# Altium schematic sheet Sheet1.SchDoc
size A4
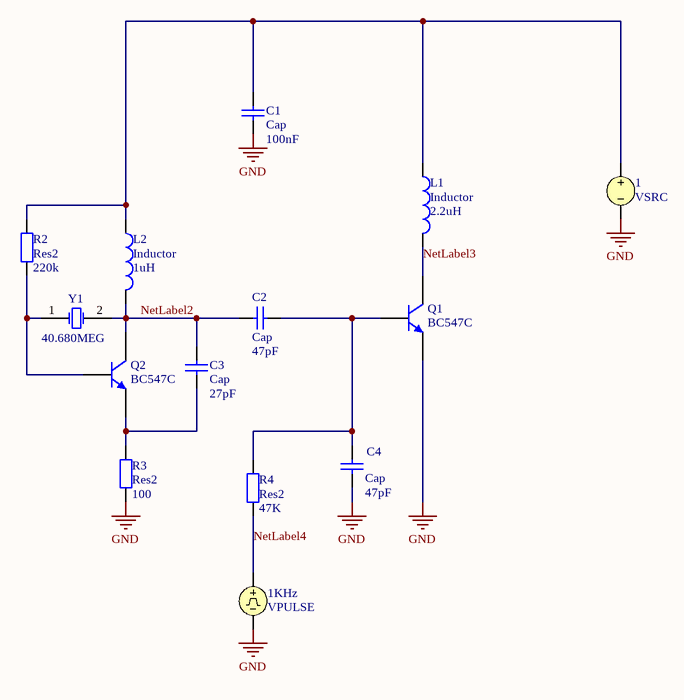
[diagram p0: Sheet1.SchDoc]

## Parts
1  VSRC
1KHz  VPULSE
C1  Cap  value 100nF  [RAD-0.3]
C2  Cap  value 47pF  [RAD-0.3]
C3  Cap  value 27pF  [RAD-0.3]
C4  Cap  value 47pF  [RAD-0.3]
L1  Inductor  value 2.2uH  [L0603]
L2  Inductor  value 1uH  [L0603]
Q1  BC547C  [SOT54]
Q2  BC547C  [SOT54]
R2  Res2  value 220k  [AXIAL-0.4]
R3  Res2  value 100  [AXIAL-0.4]
R4  Res2  value 47K  [AXIAL-0.4]
Y1  FREQ: 40.680MEG  [HC-49U]  (hidden comment: ECS-498.6-20-1)

## Nets
GND: 1.2 1KHz.2 C1.1 C4.1 Q1.1(E) R3.1
NetLabel2: C2.1 C3.2 L2.2 Q2.3(C) Y1.2(OSC2)
NetLabel3: L1.2 Q1.3(C)
NetLabel4: 1KHz.1 R4.1
Net1_1: 1.1 C1.2 L1.1 L2.1 R2.2
NetC2_2: C2.2 C4.2 Q1.2(B) R4.2
NetC3_1: C3.1 Q2.1(E) R3.2
NetQ2_2: Q2.2(B) R2.1 Y1.1(OSC1)

## Library data of the parts
1 = VSRC: Voltage Source; Note: PCB Footprint - Not required; Value: +9; Published: 8-Jun-2000; LatestRevisionDate: 17-Jul-2002; LatestRevisionNote: Re-released for DXP Platform.; PackageReference: Not Applicable; Publisher: Altium Limited
1KHz = VPULSE: Pulse Voltage Source; Note: PCB Footprint - Not required; Published: 8-Jun-2000; LatestRevisionDate: 15-Nov-2004; LatestRevisionNote: Corrected Netlist.; PackageReference: Not Applicable; Publisher: Altium Limited
C1-C4 = Cap: Capacitor; Published: 8-Jun-2000; LatestRevisionDate: 17-Jul-2002; LatestRevisionNote: Re-released for DXP Platform.; PackageReference: RAD-0.3; Publisher: Altium Limited
L1 L2 = Inductor: Code_IEC: 1005; Published: 8-Jun-2000; LatestRevisionDate: 17-Jul-2002; LatestRevisionNote: Re-released for DXP Platform.; PackageReference: 0402-A; Publisher: Altium Limited; Code_JEITA: 0402
Q1 Q2 = BC547C: NPN General-purpose Transistor; Published: 17-Sep-2003; LatestRevisionDate: 12-Dec-2006; LatestRevisionNote: Footprint pad sequence fixed.; DatasheetVersion: 15-Apr-1999; PackageVersion: Feb-1997; PackageReference: SOT54; Publisher: Altium Limited; PackageDescription: Plastic Single-Ended Leaded (through hole) package; 3 Leads (TO-92); Code_JEITA: SC-43; Code_JEDEC: TO-92; ComponentLink1Description: Manufacturer Link; ComponentLink1URL: http://www.semiconductors.philips.com/; ComponentLink2Description: Datasheet; ComponentLink2URL: http://www.semiconductors.philips.com/acrobat/datasheets/BC546_547_3.pdf
R2-R4 = Res2: Resistor; Published: 8-Jun-2000; LatestRevisionDate: 17-Jul-2002; LatestRevisionNote: Re-released for DXP Platform.; PackageReference: AXIAL-0.4; Publisher: Altium Limited
Y1 = ECS-498.6-20-1: Crystal Oscillator; Published: 17-Jul-2002; DatasheetDocument: 18-Apr-2000; PackageReference: HC-49U; Publisher: Altium Limited; ComponentLink1Description: Manufacturer Link; ComponentLink1URL: http://www.ecsxtal.com/; ComponentLink2Description: Datasheet; ComponentLink2URL: http://www.ecsxtal.com/pdf2/HC49U.PDF